# EAGLE schematic main_board (EAGLE 9.6.2)
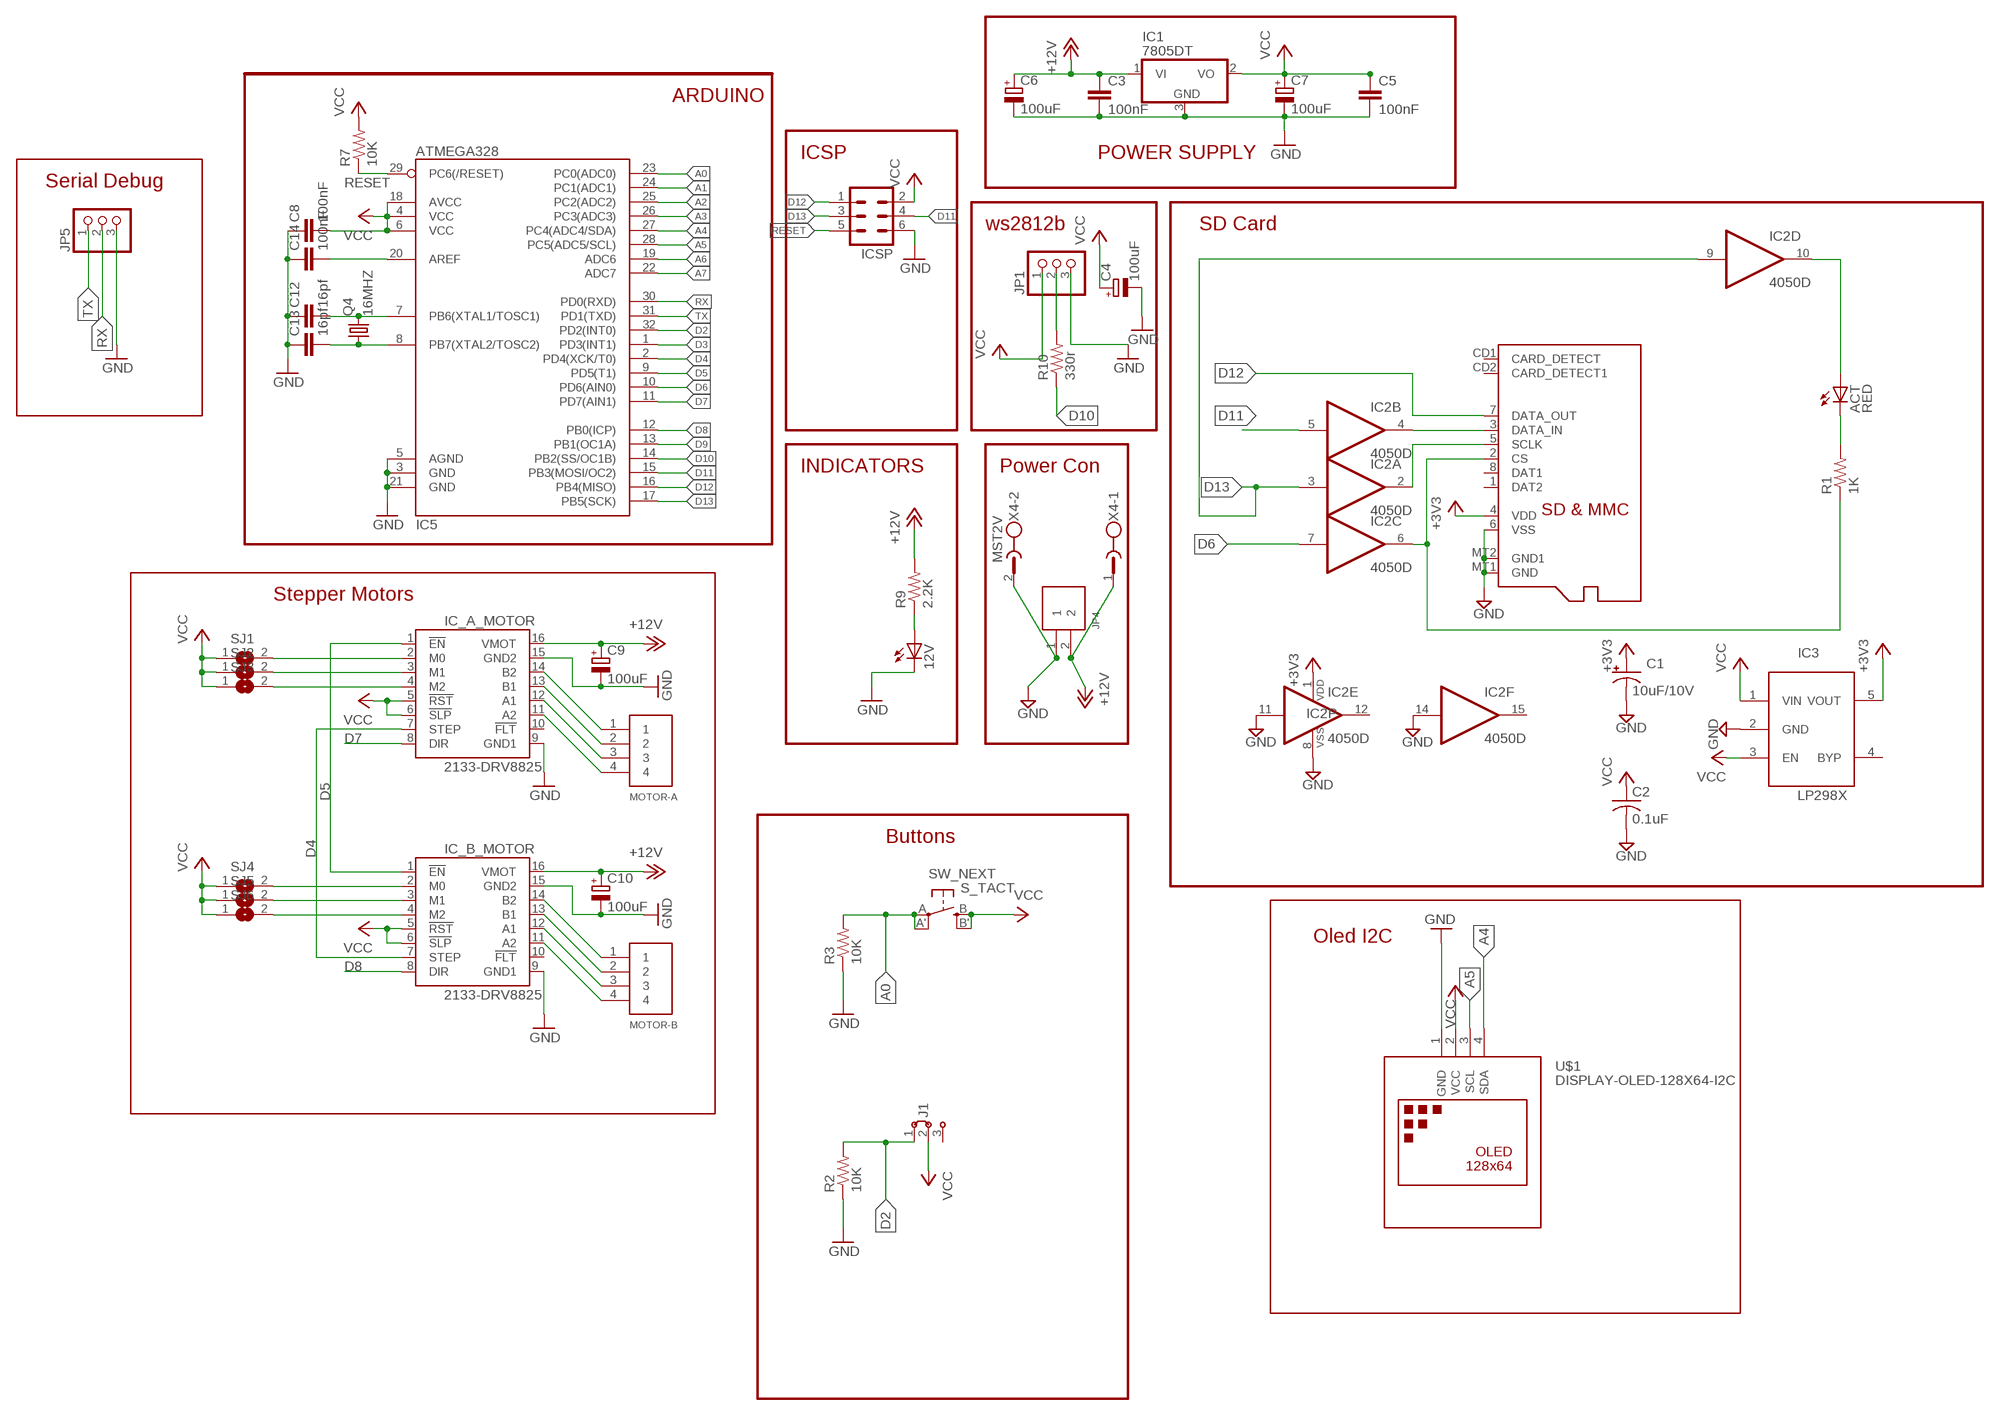
[diagram p0: schematic, sheet 1]

## Parts
12V  LED0805  [LED-0805]
ACT  RED  LEDCHIP-LED0805  [CHIP-LED0805]
C1  10uF/10V  CPOL-USA/3216-18R  [A/3216-18R]
C2  0.1uF  C-USC0805K  [C0805K]
C3  100nF  CAP0805  [0805]
C4  100uF  CPOL-EUE3.5-8  [E3,5-8]
C5  100nF  CAP0805  [0805]
C6  100uF  CPOL-EUE3.5-8  [E3,5-8]
C7  100uF  CPOL-EUE3.5-8  [E3,5-8]
C8  100nF  CAP0805  [0805]
C9  100uF  CPOL-EUE3.5-8  [E3,5-8]
C10  100uF  CPOL-EUE3.5-8  [E3,5-8]
C12  16pf  CAP0805  [0805]
C13  16pf  CAP0805  [0805]
C14  100nF  CAP0805  [0805]
IC1  7805DT  [TO252]
IC2  4050D  [SO16]
IC3  LP298XS  [SOT23-5L]
IC5  ATMEGA328  ATMEGA168  [TQFP32-08]
IC_A_MOTOR  2133-DRV8825  [DRV8825]
IC_B_MOTOR  2133-DRV8825  [DRV8825]
ICSP  ML6  [ML6]
J1  J2X5MM  [05C]
JP1  PINHD-1X3  [1X03]
JP4  2PIN  [B2B-PH-K-S]
JP5  PINHD-1X3  [1X03]
MOTOR-A  4PIN  [B4B-PH-K-S]
MOTOR-B  4PIN  [B4B-PH-K-S]
Q4  16MHZ  CRYSTALHC49S  [HC49/S]
R1  1K  R-US_R0805  [R0805]
R2  10K  R-US_R0805  [R0805]
R3  10K  R-US_R0805  [R0805]
R7  10K  RESISTOR  [0805]
R9  2.2K  RESISTOR  [0805]
R10  330r  R-US_R0805  [R0805]
SJ1  SJ  [SJ]
SJ2  SJ  [SJ]
SJ3  SJ  [SJ]
SJ4  SJ  [SJ]
SJ5  SJ  [SJ]
SJ6  SJ  [SJ]
SW_NEXT  S_TACT  SPST_TACT-EVQQ2  [EVQ-Q2]
U$1  DISPLAY-OLED-128X64-I2C  [DISPLAY-OLED-128X64-I2C]
X1  MICROSD  [MICROSD]
X4  MST2V  [MSTBV2]

## Nets
+3V3: C1.+ IC2.1(P:VDD) IC3.5(VOUT) X1.4(VDD)
+12V [highcurrent]: C3.1 C6.+ C9.+ C10.+ IC1.1(VI) IC_A_MOTOR.16(VMOT) IC_B_MOTOR.16(VMOT) JP4.2 R9.2 X4.1
A0: IC5.23(PC0(ADC0)) R3.2 SW_NEXT.A'(P1) SW_NEXT.A(P)
A1: IC5.24(PC1(ADC1))
A2: IC5.25(PC2(ADC2))
A3: IC5.26(PC3(ADC3))
A4: IC5.27(PC4(ADC4/SDA)) U$1.4(SDA)
A5: IC5.28(PC5(ADC5/SCL)) U$1.3(SCL)
A6: IC5.19(ADC6)
A7: IC5.22(ADC7)
D2: IC5.32(PD2(INT0)) J1.1 R2.2
D3: IC5.1(PD3(INT1))
D4: IC5.2(PD4(XCK/T0)) IC_A_MOTOR.7(STEP) IC_B_MOTOR.7(STEP)
D5: IC5.9(PD5(T1)) IC_A_MOTOR.1(!EN) IC_B_MOTOR.1(!EN)
D6: IC2.7(C:I) IC5.10(PD6(AIN0))
D7: IC5.11(PD7(AIN1)) IC_A_MOTOR.8(DIR)
D8: IC5.12(PB0(ICP)) IC_B_MOTOR.8(DIR)
D9: IC5.13(PB1(OC1A))
D10: IC5.14(PB2(SS/OC1B)) R10.1
D11: IC2.5(B:I) IC5.15(PB3(MOSI/OC2)) ICSP.4
D12: IC5.16(PB4(MISO)) ICSP.1 X1.7(DATA_OUT)
D13: IC2.3(A:I) IC2.9(D:I) IC5.17(PB5(SCK)) ICSP.3
GND: 12V.C C1.- C2.2 C3.2 C4.- C5.2 C6.- C7.- C8.1 C9.- C10.- C12.1 C13.1 C14.1 IC1.3(GND) IC2.8(P:VSS) IC2.11(E:I) IC2.14(F:I) IC3.2(GND) IC5.3(GND) IC5.5(AGND) IC5.21(GND) IC_A_MOTOR.9(GND1) IC_A_MOTOR.15(GND2) IC_B_MOTOR.9(GND1) IC_B_MOTOR.15(GND2) ICSP.6 JP1.3 JP4.1 JP5.3 R2.1 R3.1 U$1.1(GND) X1.6(VSS) X1.MT1(GND) X1.MT2(GND1) X4.2
N$1: ACT.A IC2.10(D:O)
N$2: IC2.2(A:O) X1.5(SCLK)
N$3: IC2.6(C:O) R1.1 X1.2(CS)
N$4: ACT.C R1.2
N$5: IC2.4(B:O) X1.3(DATA_IN)
N$6: JP1.2 R10.2
N$7: IC_A_MOTOR.2(M0) SJ1.2
N$8: IC_A_MOTOR.3(M1) SJ2.2
N$9: IC_A_MOTOR.4(M2) SJ3.2
N$10: IC_B_MOTOR.2(M0) SJ4.2
N$11: IC_B_MOTOR.3(M1) SJ5.2
N$12: IC_B_MOTOR.4(M2) SJ6.2
N$13 [highcurrent]: IC_A_MOTOR.14(B2) MOTOR-A.1
N$14 [highcurrent]: IC_A_MOTOR.13(B1) MOTOR-A.2
N$15 [highcurrent]: IC_A_MOTOR.12(A1) MOTOR-A.3
N$16 [highcurrent]: IC_A_MOTOR.11(A2) MOTOR-A.4
N$17 [highcurrent]: IC_B_MOTOR.14(B2) MOTOR-B.1
N$18 [highcurrent]: IC_B_MOTOR.13(B1) MOTOR-B.2
N$19 [highcurrent]: IC_B_MOTOR.12(A1) MOTOR-B.3
N$20: C14.2 IC5.20(AREF)
N$21 [highcurrent]: IC_B_MOTOR.11(A2) MOTOR-B.4
N$26: 12V.A R9.1
N$31: C12.2 IC5.7(PB6(XTAL1/TOSC1)) Q4.2
N$32: C13.2 IC5.8(PB7(XTAL2/TOSC2)) Q4.1
RESET: IC5.29(PC6(/RESET)) ICSP.5 R7.1
RX: IC5.30(PD0(RXD)) JP5.2
TX: IC5.31(PD1(TXD)) JP5.1
VCC: C2.1 C4.+ C5.1 C7.+ C8.2 IC1.2(VO) IC3.1(VIN) IC3.3(EN) IC5.4(VCC) IC5.6(VCC) IC5.18(AVCC) IC_A_MOTOR.5(!RST) IC_A_MOTOR.6(!SLP) IC_B_MOTOR.5(!RST) IC_B_MOTOR.6(!SLP) ICSP.2 J1.2 JP1.1 R7.2 SJ1.1 SJ2.1 SJ3.1 SJ4.1 SJ5.1 SJ6.1 SW_NEXT.B'(S1) SW_NEXT.B(S) U$1.2(VCC)
Unconnected: IC2.12(E:O) IC2.15(F:O) IC3.4(BYP) IC_A_MOTOR.10(!FLT) IC_B_MOTOR.10(!FLT) J1.3 X1.1(DAT2) X1.8(DAT1) X1.CD1(CARD_DETECT) X1.CD2(CARD_DETECT1)

## Notes on the sheet
- ARDUINO
- ICSP | POWER SUPPLY
- Serial Debug
- ws2812b | SD Card
- INDICATORS | Power Con
- Stepper Motors
- Buttons
- Oled I2C

## Library data of the parts
12V = SparkFun:LED: LEDs Standard schematic elements and footprints for 5mm, 3mm, 1206, and 0603 sized LEDs. 5mm - Spark Fun Electronics SKU : COM-00529 (and others)
ACT = adafruit:LED: LED OSRAM: - CHIPLED LG R971, LG N971, LY N971, LG Q971, LY Q971, LO R971, LY R971 LH N974, LH R974 LS Q976, LO Q976, LY Q976 LO Q996 - Hyper CHIPLED LW Q18S LB Q993, LB Q99A, LB R99A - SideLED LS A670, LO A670, LY A670, LG A670, LP A670 LB A673, LV A673, LT A673, LW A673 LH A674 LY A675 LS A676, LA A676, LO A676, LY A676, LW A676 LS A679, LY A679, LG A679 - Hyper Micro SIDELED® LS Y876, LA Y876, LO Y876, LY Y876 LT Y87S - SmartLED LW L88C, LW L88S LB L89C, LB L89S, LG L890 LS L89K, LO L89K, LY L89K LS L896, LA L896, LO L896, LY L896 - TOPLED LS T670, LO T670, LY T670, LG T670, LP T670 LSG T670, LSP T670, LSY T670, LOP T670, LYG T670 LG T671, LOG T671, LSG T671 LB T673, LV T673, LT T673, LW T673 LH T674 LS T676, LA T676, LO T676, LY T676, LB T676, LH T676, LSB T676, LW T676 LB T67C, LV T67C, LT T67C, LS T67K, LO T67K, LY T67K, LW E67C LS E67B, LA E67B, LO E67B, LY E67B, LB E67C, LV E67C, LT E67C LW T67C LS T679, LY T679, LG T679 LS T770, LO T770, LY T770, LG T770, LP T770 LB T773, LV T773, LT T773, LW T773 LH T774 LS E675, LA E675, LY E675, LS T675 LS T776, LA T776, LO T776, LY T776, LB T776 LHGB T686 LT T68C, LB T68C - Hyper Mini TOPLED® LB M676 - Mini TOPLED Santana® LG M470 LS M47K, LO M47K, LY M47K Source: http://www.osram.convergy.de/
C1 = adafruit:CPOL-US: POLARIZED CAPACITOR, American symbol
C2 = adafruit:C-US: CAPACITOR, American symbol
C3 C5 C8 C12-C14 = SparkFun:CAP: Capacitor Standard 0603 ceramic capacitor, and 0.1" leaded capacitor.
C4 C6 C7 C9 C10 = rcl:CPOL-EU: POLARIZED CAPACITOR, European symbol
IC1 = linear:78*: Positive VOLTAGE REGULATOR Source: http://cache.national.com/ds/LM/LM78L05.pdf http://www.fairchildsemi.com/ds/LM/LM7805.pdf
IC2 = 40xx:4050: Hex non-inverting BUFFER
IC3 = adafruit:LP298X
IC5 = SparkFun:ATMEGA168
IC_A_MOTOR IC_B_MOTOR = pololu-stepper-driver:2133-DRV8825: DRV8825 Stepper Motor Driver Carrier, High Current #2133 DRV8825 Stepper Motor Driver Carrier; High Current <https://www.pololu.com/product/2133> in Japan, Suzaku Lab. Ltd. <https://suzakugiken.jp/> #2133 DRV8825 大電流用ステッピングモータドライバ <https://szc.jp/po2133>
ICSP = con-harting-ml:ML6: HARTING
J1 = jumper:J2: Jumper switch 2 x 2.5 mm
JP1 JP5 = adafruit:PINHD-1X3: PIN HEADER
JP4 = jst_eph:2PIN
MOTOR-A MOTOR-B = jst_eph:4PIN
Q4 = crystal:CRYSTAL: CRYSTAL
R1-R3 R10 = adafruit:R-US_: RESISTOR, American symbol
R7 R9 = SparkFun:RESISTOR: Resistor Basic schematic elements and footprints for 0603, 1206, and PTH 1/10th watt (small) resistors.
SJ1-SJ6 = jumper:SJ: SMD solder JUMPER
SW_NEXT = adafruit:SPST_TACT: SMT 6mm switch, EVQQ2 series http://www.ladyada.net/library/eagle
U$1 = diy-modules:DISPLAY-OLED-128X64-I2C: 128x64 Dot Matrix OLED Module based on SSD1306 chip Variant with I2C interface More details available here: http://www.instructables.com/id/Monochrome-096-i2c-OLED-display-with-arduino-SSD13/ SSD1306 datasheet: https://cdn-shop.adafruit.com/datasheets/SSD1306.pdf Click here to find device on ebay.com <http://www.ebay.com/sch/oled+display+128x64+iic> Note: There are two variants: I2C and SPI. Search for the proper version.
X1 = adafruit:MICROSD: Micro-SD / Transflash card holder with SPI pinout For the 3M # 2908-05WB-MG and/or 4UCON #19656 push-push type
X4 = con-phoenix-508:MST2V: PHOENIX

## Net classes
0 default: width 0.305 mm
1 highcurrent: width 0.61 mm